# Altium schematic sheet [04] - LEDs.SchDoc
size A4
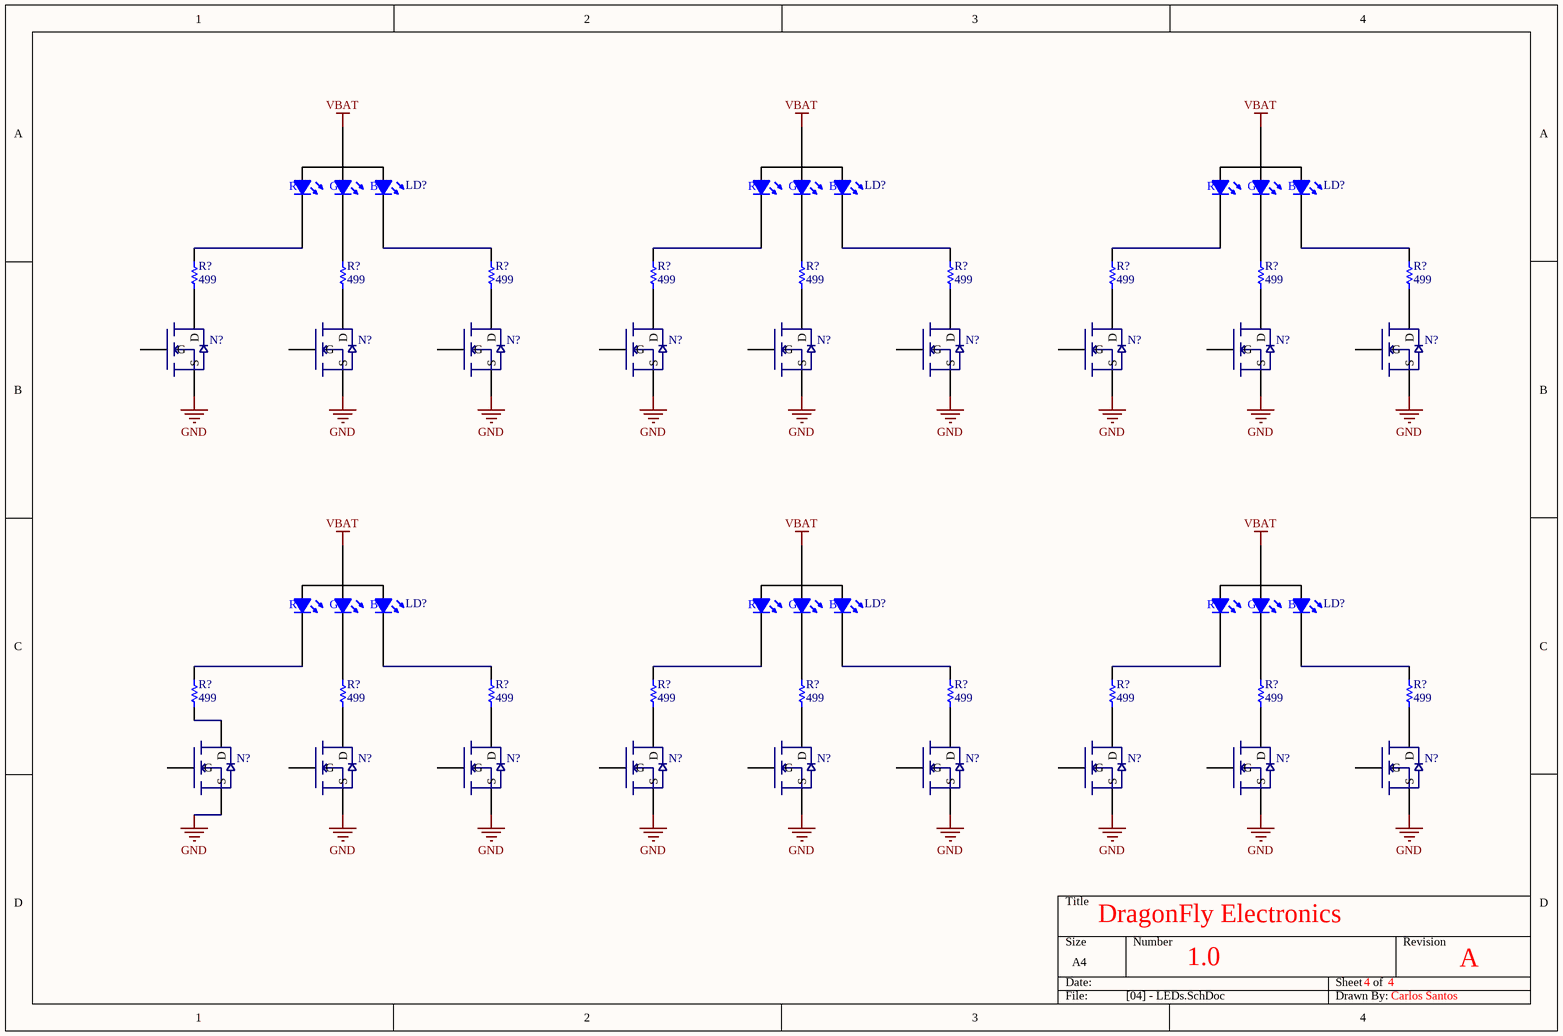
[diagram p0: [04] - LEDs.SchDoc]

## Parts
(Parts that share a designator on the sheet are numbered #1, #2 ... from top to bottom, then left to right.)
LD?#1  1  [0404 RGD Led]  (value not drawn)
LD?#2  1  [0404 RGD Led]  (value not drawn)
LD?#3  1  [0404 RGD Led]  (value not drawn)
LD?#4  1  [0404 RGD Led]  (value not drawn)
LD?#5  1  [0404 RGD Led]  (value not drawn)
LD?#6  1  [0404 RGD Led]  (value not drawn)
N?#1  N-MOSFET  [SOT 23 - 3]  (value not drawn)
N?#2  N-MOSFET  [SOT 23 - 3]  (value not drawn)
N?#3  N-MOSFET  [SOT 23 - 3]  (value not drawn)
N?#4  N-MOSFET  [SOT 23 - 3]  (value not drawn)
N?#5  N-MOSFET  [SOT 23 - 3]  (value not drawn)
N?#6  N-MOSFET  [SOT 23 - 3]  (value not drawn)
N?#7  N-MOSFET  [SOT 23 - 3]  (value not drawn)
N?#8  N-MOSFET  [SOT 23 - 3]  (value not drawn)
N?#9  N-MOSFET  [SOT 23 - 3]  (value not drawn)
N?#10  N-MOSFET  [SOT 23 - 3]  (value not drawn)
N?#11  N-MOSFET  [SOT 23 - 3]  (value not drawn)
N?#12  N-MOSFET  [SOT 23 - 3]  (value not drawn)
N?#13  N-MOSFET  [SOT 23 - 3]  (value not drawn)
N?#14  N-MOSFET  [SOT 23 - 3]  (value not drawn)
N?#15  N-MOSFET  [SOT 23 - 3]  (value not drawn)
N?#16  N-MOSFET  [SOT 23 - 3]  (value not drawn)
N?#17  N-MOSFET  [SOT 23 - 3]  (value not drawn)
N?#18  N-MOSFET  [SOT 23 - 3]  (value not drawn)
R?#1  value 499  [0402 - Resistor]  (hidden comment: Resistor)
R?#2  value 499  [0402 - Resistor]  (hidden comment: Resistor)
R?#3  value 499  [0402 - Resistor]  (hidden comment: Resistor)
R?#4  value 499  [0402 - Resistor]  (hidden comment: Resistor)
R?#5  value 499  [0402 - Resistor]  (hidden comment: Resistor)
R?#6  value 499  [0402 - Resistor]  (hidden comment: Resistor)
R?#7  value 499  [0402 - Resistor]  (hidden comment: Resistor)
R?#8  value 499  [0402 - Resistor]  (hidden comment: Resistor)
R?#9  value 499  [0402 - Resistor]  (hidden comment: Resistor)
R?#10  value 499  [0402 - Resistor]  (hidden comment: Resistor)
R?#11  value 499  [0402 - Resistor]  (hidden comment: Resistor)
R?#12  value 499  [0402 - Resistor]  (hidden comment: Resistor)
R?#13  value 499  [0402 - Resistor]  (hidden comment: Resistor)
R?#14  value 499  [0402 - Resistor]  (hidden comment: Resistor)
R?#15  value 499  [0402 - Resistor]  (hidden comment: Resistor)
R?#16  value 499  [0402 - Resistor]  (hidden comment: Resistor)
R?#17  value 499  [0402 - Resistor]  (hidden comment: Resistor)
R?#18  value 499  [0402 - Resistor]  (hidden comment: Resistor)

## Nets
GND: N?#1.1(S) N?#2.1(S) N?#3.1(S) N?#4.1(S) N?#5.1(S) N?#6.1(S) N?#7.1(S) N?#8.1(S) N?#9.1(S) N?#10.1(S) N?#11.1(S) N?#12.1(S) N?#13.1(S) N?#14.1(S) N?#15.1(S) N?#16.1(S) N?#17.1(S) N?#18.1(S)
VBAT: LD?#1.1(A) LD?#2.1(A) LD?#3.1(A) LD?#4.1(A) LD?#5.1(A) LD?#6.1(A)
NetLD?#1_2: LD?#1.2(K) R?#1.2
NetLD?#1_3: LD?#1.3 R?#2.2
NetLD?#1_4: LD?#1.4 R?#3.2
NetLD?#2_2: LD?#2.2(K) R?#4.2
NetLD?#2_3: LD?#2.3 R?#5.2
NetLD?#2_4: LD?#2.4 R?#6.2
NetLD?#3_2: LD?#3.2(K) R?#7.2
NetLD?#3_3: LD?#3.3 R?#8.2
NetLD?#3_4: LD?#3.4 R?#9.2
NetLD?#4_2: LD?#4.2(K) R?#10.2
NetLD?#4_3: LD?#4.3 R?#11.2
NetLD?#4_4: LD?#4.4 R?#12.2
NetLD?#5_2: LD?#5.2(K) R?#13.2
NetLD?#5_3: LD?#5.3 R?#14.2
NetLD?#5_4: LD?#5.4 R?#15.2
NetLD?#6_2: LD?#6.2(K) R?#16.2
NetLD?#6_3: LD?#6.3 R?#17.2
NetLD?#6_4: LD?#6.4 R?#18.2
NetN?#1_3: N?#1.3(D) R?#1.1
NetN?#2_3: N?#2.3(D) R?#2.1
NetN?#3_3: N?#3.3(D) R?#3.1
NetN?#4_3: N?#4.3(D) R?#4.1
NetN?#5_3: N?#5.3(D) R?#5.1
NetN?#6_3: N?#6.3(D) R?#6.1
NetN?#7_3: N?#7.3(D) R?#7.1
NetN?#8_3: N?#8.3(D) R?#8.1
NetN?#9_3: N?#9.3(D) R?#9.1
NetN?#10_3: N?#10.3(D) R?#10.1
NetN?#11_3: N?#11.3(D) R?#11.1
NetN?#12_3: N?#12.3(D) R?#12.1
NetN?#13_3: N?#13.3(D) R?#13.1
NetN?#14_3: N?#14.3(D) R?#14.1
NetN?#15_3: N?#15.3(D) R?#15.1
NetN?#16_3: N?#16.3(D) R?#16.1
NetN?#17_3: N?#17.3(D) R?#17.1
NetN?#18_3: N?#18.3(D) R?#18.1

Not connected (* = marked no-connect by the designer): N?#1 2(G); N?#2 2(G); N?#3 2(G); N?#4 2(G); N?#5 2(G); N?#6 2(G); N?#7 2(G); N?#8 2(G); N?#9 2(G); N?#10 2(G); N?#11 2(G); N?#12 2(G); N?#13 2(G); N?#14 2(G); N?#15 2(G); N?#16 2(G); N?#17 2(G); N?#18 2(G)

## Notes on the sheet
- DragonFly Electronics
- 1.0
- 4
- A
- Carlos Santos
- (in symbol RGB LED) R; G; B

## Library data of the parts
LD?#1-LD?#6 = RGB LED: DigiKey Part #: 475-3597-1-ND
N?#1-N?#18 = N-MOSFET: pin to pad: 1>2 2>1